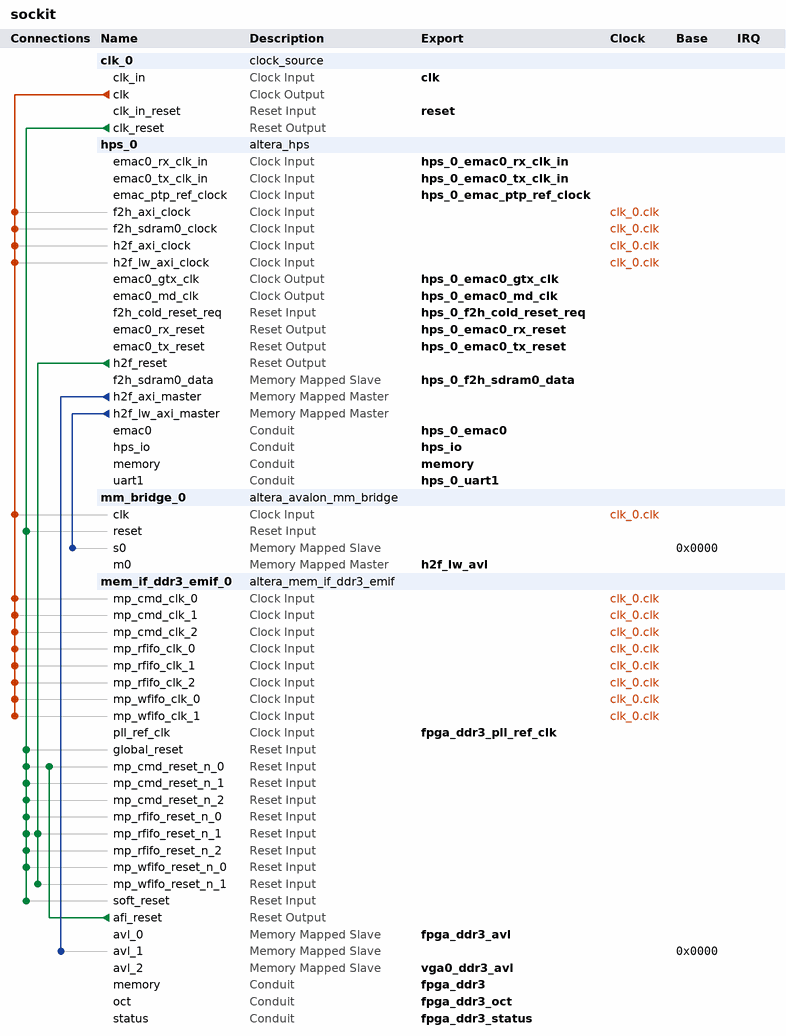
[diagram p0: system contents]
# Platform Designer (Qsys) system sockit, Cyclone V 5CSXFC6D6F31C8ES
# Parameters at their usual value, and those the tool derives, are not listed.
package require -exact qsys 13.0
create_system sockit
set_project_property DEVICE_FAMILY {Cyclone V}
set_project_property DEVICE 5CSXFC6D6F31C8ES

add_instance clk_0 clock_source 13.0
set_instance_parameter_value clk_0 clockFrequency 50000000

add_instance hps_0 altera_hps 13.0.1
set_instance_parameter_value hps_0 MEM_VENDOR Micron
set_instance_parameter_value hps_0 MEM_ROW_ADDR_WIDTH 15
set_instance_parameter_value hps_0 MEM_COL_ADDR_WIDTH 10
set_instance_parameter_value hps_0 MEM_DQ_WIDTH 32
set_instance_parameter_value hps_0 MEM_BANKADDR_WIDTH 3
set_instance_parameter_value hps_0 MEM_DRV_STR RZQ/7
set_instance_parameter_value hps_0 MEM_RTT_NOM RZQ/4
set_instance_parameter_value hps_0 MEM_RTT_WR RZQ/4
set_instance_parameter_value hps_0 MEM_WTCL 8
set_instance_parameter_value hps_0 MEM_TCL 11
set_instance_parameter_value hps_0 TIMING_TIS 180
set_instance_parameter_value hps_0 TIMING_TIH 140
set_instance_parameter_value hps_0 TIMING_TDS 30
set_instance_parameter_value hps_0 TIMING_TDH 65
set_instance_parameter_value hps_0 TIMING_TDQSQ 125
set_instance_parameter_value hps_0 TIMING_TDQSCK 255
set_instance_parameter_value hps_0 TIMING_TQSH 0.4
set_instance_parameter_value hps_0 MEM_TRAS_NS 35.0
set_instance_parameter_value hps_0 MEM_TRCD_NS 13.75
set_instance_parameter_value hps_0 MEM_TRP_NS 13.75
set_instance_parameter_value hps_0 MEM_TRFC_NS 260.0
set_instance_parameter_value hps_0 MEM_TFAW_NS 30.0
set_instance_parameter_value hps_0 REF_CLK_FREQ 25.0
set_instance_parameter_value hps_0 DEFAULT_FAST_SIM_MODEL true
set_instance_parameter_value hps_0 TIMING_BOARD_MAX_CK_DELAY 0.03
set_instance_parameter_value hps_0 TIMING_BOARD_MAX_DQS_DELAY 0.02
set_instance_parameter_value hps_0 TIMING_BOARD_SKEW_CKDQS_DIMM_MIN 0.09
set_instance_parameter_value hps_0 TIMING_BOARD_SKEW_CKDQS_DIMM_MAX 0.16
set_instance_parameter_value hps_0 TIMING_BOARD_SKEW_WITHIN_DQS 0.02
set_instance_parameter_value hps_0 TIMING_BOARD_SKEW_BETWEEN_DQS 0.08
set_instance_parameter_value hps_0 TIMING_BOARD_DQ_TO_DQS_SKEW 0.0
set_instance_parameter_value hps_0 TIMING_BOARD_AC_SKEW 0.03
set_instance_parameter_value hps_0 TIMING_BOARD_AC_TO_CK_SKEW 0.0
set_instance_parameter_value hps_0 MEM_CLK_FREQ 400.0
set_instance_parameter_value hps_0 HPS_PROTOCOL DDR3
set_instance_parameter_value hps_0 STM_Enable false
set_instance_parameter_value hps_0 F2S_Width 2
set_instance_parameter_value hps_0 S2F_Width 2
set_instance_parameter_value hps_0 LWH2F_Enable true
set_instance_parameter_value hps_0 F2SDRAM_Type {Avalon-MM Bidirectional}
set_instance_parameter_value hps_0 F2SDRAM_Width 32
set_instance_parameter_value hps_0 F2SCLK_DBGRST_Enable false
set_instance_parameter_value hps_0 F2SCLK_WARMRST_Enable false
set_instance_parameter_value hps_0 F2SCLK_COLDRST_Enable true
set_instance_parameter_value hps_0 F2SINTERRUPT_Enable false
set_instance_parameter_value hps_0 EMAC0_PinMuxing FPGA
set_instance_parameter_value hps_0 EMAC0_Mode Full
set_instance_parameter_value hps_0 EMAC1_PinMuxing {HPS I/O Set 0}
set_instance_parameter_value hps_0 EMAC1_Mode RGMII
set_instance_parameter_value hps_0 QSPI_PinMuxing {HPS I/O Set 0}
set_instance_parameter_value hps_0 QSPI_Mode {1 SS}
set_instance_parameter_value hps_0 SDIO_PinMuxing {HPS I/O Set 0}
set_instance_parameter_value hps_0 SDIO_Mode {4-bit Data}
set_instance_parameter_value hps_0 USB1_PinMuxing {HPS I/O Set 0}
set_instance_parameter_value hps_0 USB1_Mode SDR
set_instance_parameter_value hps_0 SPIM0_PinMuxing {HPS I/O Set 0}
set_instance_parameter_value hps_0 SPIM0_Mode {Single Slave Select}
set_instance_parameter_value hps_0 SPIM1_PinMuxing {HPS I/O Set 0}
set_instance_parameter_value hps_0 SPIM1_Mode {Single Slave Select}
set_instance_parameter_value hps_0 UART0_PinMuxing {HPS I/O Set 0}
set_instance_parameter_value hps_0 UART0_Mode {No Flow Control}
set_instance_parameter_value hps_0 UART1_PinMuxing FPGA
set_instance_parameter_value hps_0 UART1_Mode Full
set_instance_parameter_value hps_0 I2C0_PinMuxing Unused
set_instance_parameter_value hps_0 I2C0_Mode N/A
set_instance_parameter_value hps_0 I2C1_PinMuxing {HPS I/O Set 0}
set_instance_parameter_value hps_0 I2C1_Mode I2C
set_instance_parameter_value hps_0 S2FCLK_USER1CLK_FREQ 100
set_instance_parameter_value hps_0 FPGA_PERIPHERAL_OUTPUT_CLOCK_FREQ_EMAC0_MD_CLK 100
set_instance_parameter_value hps_0 FPGA_PERIPHERAL_OUTPUT_CLOCK_FREQ_EMAC0_GTX_CLK 100
set_instance_parameter_value hps_0 FPGA_PERIPHERAL_OUTPUT_CLOCK_FREQ_EMAC1_MD_CLK 100
set_instance_parameter_value hps_0 FPGA_PERIPHERAL_OUTPUT_CLOCK_FREQ_EMAC1_GTX_CLK 100
set_instance_parameter_value hps_0 quartus_ini_hps_ip_enable_loanio false

add_instance mm_bridge_0 altera_avalon_mm_bridge 13.0
set_instance_parameter_value mm_bridge_0 DATA_WIDTH 32
set_instance_parameter_value mm_bridge_0 ADDRESS_WIDTH 21
set_instance_parameter_value mm_bridge_0 ADDRESS_UNITS SYMBOLS
set_instance_parameter_value mm_bridge_0 MAX_PENDING_RESPONSES 4
set_instance_parameter_value mm_bridge_0 LINEWRAPBURSTS 1

add_instance mem_if_ddr3_emif_0 altera_mem_if_ddr3_emif 13.0
set_instance_parameter_value mem_if_ddr3_emif_0 MEM_VENDOR Micron
set_instance_parameter_value mem_if_ddr3_emif_0 MEM_FORMAT DISCRETE
set_instance_parameter_value mem_if_ddr3_emif_0 MEM_CLK_FREQ_MAX 800.0
set_instance_parameter_value mem_if_ddr3_emif_0 MEM_ROW_ADDR_WIDTH 15
set_instance_parameter_value mem_if_ddr3_emif_0 MEM_COL_ADDR_WIDTH 10
set_instance_parameter_value mem_if_ddr3_emif_0 MEM_DQ_WIDTH 32
set_instance_parameter_value mem_if_ddr3_emif_0 MEM_BANKADDR_WIDTH 3
set_instance_parameter_value mem_if_ddr3_emif_0 MEM_WTCL 5
set_instance_parameter_value mem_if_ddr3_emif_0 MEM_TCL 6
set_instance_parameter_value mem_if_ddr3_emif_0 TIMING_TIS 200
set_instance_parameter_value mem_if_ddr3_emif_0 TIMING_TIH 275
set_instance_parameter_value mem_if_ddr3_emif_0 TIMING_TDS 75
set_instance_parameter_value mem_if_ddr3_emif_0 TIMING_TDH 150
set_instance_parameter_value mem_if_ddr3_emif_0 TIMING_TDQSQ 200
set_instance_parameter_value mem_if_ddr3_emif_0 TIMING_TDQSCK 400
set_instance_parameter_value mem_if_ddr3_emif_0 TIMING_TDQSS 0.25
set_instance_parameter_value mem_if_ddr3_emif_0 TIMING_TQSH 0.38
set_instance_parameter_value mem_if_ddr3_emif_0 TIMING_TDSH 0.2
set_instance_parameter_value mem_if_ddr3_emif_0 TIMING_TDSS 0.2
set_instance_parameter_value mem_if_ddr3_emif_0 MEM_TMRD_CK 3
set_instance_parameter_value mem_if_ddr3_emif_0 MEM_TRAS_NS 37.5
set_instance_parameter_value mem_if_ddr3_emif_0 MEM_TRCD_NS 15.0
set_instance_parameter_value mem_if_ddr3_emif_0 MEM_TRP_NS 15.0
set_instance_parameter_value mem_if_ddr3_emif_0 MEM_TRFC_NS 300.0
set_instance_parameter_value mem_if_ddr3_emif_0 MEM_TWTR 4
set_instance_parameter_value mem_if_ddr3_emif_0 MEM_TFAW_NS 50.0
set_instance_parameter_value mem_if_ddr3_emif_0 MEM_TRRD_NS 13.2
set_instance_parameter_value mem_if_ddr3_emif_0 MEM_TRTP_NS 13.2
set_instance_parameter_value mem_if_ddr3_emif_0 RATE Full
set_instance_parameter_value mem_if_ddr3_emif_0 MEM_CLK_FREQ 300.0
set_instance_parameter_value mem_if_ddr3_emif_0 SPEED_GRADE 8
set_instance_parameter_value mem_if_ddr3_emif_0 HARD_EMIF true
set_instance_parameter_value mem_if_ddr3_emif_0 POWER_OF_TWO_BUS true
set_instance_parameter_value mem_if_ddr3_emif_0 AVL_MAX_SIZE 32
set_instance_parameter_value mem_if_ddr3_emif_0 NUM_OF_PORTS 3
set_instance_parameter_value mem_if_ddr3_emif_0 PRIORITY_PORT 1,1,1,1,1,1
set_instance_parameter_value mem_if_ddr3_emif_0 CPORT_TYPE_PORT Bidirectional,Bidirectional,Read-only,Bidirectional,Bidirectional,Bidirectional
set_instance_parameter_value mem_if_ddr3_emif_0 REF_CLK_FREQ 50.0
set_instance_parameter_value mem_if_ddr3_emif_0 DEFAULT_FAST_SIM_MODEL true
set_instance_parameter_value mem_if_ddr3_emif_0 EXPORT_AFI_HALF_CLK false
set_instance_parameter_value mem_if_ddr3_emif_0 PLL_LOCATION Top_Bottom
set_instance_parameter_value mem_if_ddr3_emif_0 CALIBRATION_MODE Full
set_instance_parameter_value mem_if_ddr3_emif_0 USER_DEBUG_LEVEL 0
set_instance_parameter_value mem_if_ddr3_emif_0 TIMING_BOARD_MAX_CK_DELAY 0.6
set_instance_parameter_value mem_if_ddr3_emif_0 TIMING_BOARD_MAX_DQS_DELAY 0.6
set_instance_parameter_value mem_if_ddr3_emif_0 TIMING_BOARD_SKEW_CKDQS_DIMM_MIN -0.01
set_instance_parameter_value mem_if_ddr3_emif_0 TIMING_BOARD_SKEW_CKDQS_DIMM_MAX 0.01
set_instance_parameter_value mem_if_ddr3_emif_0 TIMING_BOARD_SKEW_WITHIN_DQS 0.02
set_instance_parameter_value mem_if_ddr3_emif_0 TIMING_BOARD_SKEW_BETWEEN_DQS 0.02
set_instance_parameter_value mem_if_ddr3_emif_0 TIMING_BOARD_DQ_TO_DQS_SKEW 0.0
set_instance_parameter_value mem_if_ddr3_emif_0 TIMING_BOARD_AC_SKEW 0.02
set_instance_parameter_value mem_if_ddr3_emif_0 TIMING_BOARD_AC_TO_CK_SKEW 0.0

# connections
add_connection clk_0.clk hps_0.f2h_axi_clock clock
add_connection clk_0.clk hps_0.f2h_sdram0_clock clock
add_connection clk_0.clk hps_0.h2f_axi_clock clock
add_connection clk_0.clk hps_0.h2f_lw_axi_clock clock
add_connection clk_0.clk mem_if_ddr3_emif_0.mp_cmd_clk_0 clock
add_connection clk_0.clk mem_if_ddr3_emif_0.mp_cmd_clk_1 clock
add_connection clk_0.clk mem_if_ddr3_emif_0.mp_cmd_clk_2 clock
add_connection clk_0.clk mem_if_ddr3_emif_0.mp_rfifo_clk_0 clock
add_connection clk_0.clk mem_if_ddr3_emif_0.mp_rfifo_clk_1 clock
add_connection clk_0.clk mem_if_ddr3_emif_0.mp_rfifo_clk_2 clock
add_connection clk_0.clk mem_if_ddr3_emif_0.mp_wfifo_clk_0 clock
add_connection clk_0.clk mem_if_ddr3_emif_0.mp_wfifo_clk_1 clock
add_connection clk_0.clk mm_bridge_0.clk clock
add_connection clk_0.clk_reset mem_if_ddr3_emif_0.global_reset reset
add_connection clk_0.clk_reset mem_if_ddr3_emif_0.mp_cmd_reset_n_0 reset
add_connection clk_0.clk_reset mem_if_ddr3_emif_0.mp_cmd_reset_n_1 reset
add_connection clk_0.clk_reset mem_if_ddr3_emif_0.mp_cmd_reset_n_2 reset
add_connection clk_0.clk_reset mem_if_ddr3_emif_0.mp_rfifo_reset_n_0 reset
add_connection clk_0.clk_reset mem_if_ddr3_emif_0.mp_rfifo_reset_n_1 reset
add_connection clk_0.clk_reset mem_if_ddr3_emif_0.mp_rfifo_reset_n_2 reset
add_connection clk_0.clk_reset mem_if_ddr3_emif_0.mp_wfifo_reset_n_0 reset
add_connection clk_0.clk_reset mem_if_ddr3_emif_0.soft_reset reset
add_connection clk_0.clk_reset mm_bridge_0.reset reset
add_connection hps_0.h2f_reset mem_if_ddr3_emif_0.mp_rfifo_reset_n_1 reset
add_connection hps_0.h2f_reset mem_if_ddr3_emif_0.mp_wfifo_reset_n_1 reset
add_connection mem_if_ddr3_emif_0.afi_reset mem_if_ddr3_emif_0.mp_cmd_reset_n_0 reset
add_connection hps_0.h2f_axi_master mem_if_ddr3_emif_0.avl_1 avalon
set_connection_parameter_value hps_0.h2f_axi_master/mem_if_ddr3_emif_0.avl_1 baseAddress 0x0000
add_connection hps_0.h2f_lw_axi_master mm_bridge_0.s0 avalon
set_connection_parameter_value hps_0.h2f_lw_axi_master/mm_bridge_0.s0 baseAddress 0x0000

# exported interfaces
add_interface clk clock sink
set_interface_property clk EXPORT_OF clk_0.clk_in
add_interface reset reset sink
set_interface_property reset EXPORT_OF clk_0.clk_in_reset
add_interface memory conduit end
set_interface_property memory EXPORT_OF hps_0.memory
add_interface hps_io conduit end
set_interface_property hps_io EXPORT_OF hps_0.hps_io
add_interface hps_0_uart1 conduit end
set_interface_property hps_0_uart1 EXPORT_OF hps_0.uart1
add_interface hps_0_emac0 conduit end
set_interface_property hps_0_emac0 EXPORT_OF hps_0.emac0
add_interface hps_0_emac0_md_clk clock source
set_interface_property hps_0_emac0_md_clk EXPORT_OF hps_0.emac0_md_clk
add_interface hps_0_emac0_rx_clk_in clock sink
set_interface_property hps_0_emac0_rx_clk_in EXPORT_OF hps_0.emac0_rx_clk_in
add_interface hps_0_emac0_tx_clk_in clock sink
set_interface_property hps_0_emac0_tx_clk_in EXPORT_OF hps_0.emac0_tx_clk_in
add_interface hps_0_emac0_gtx_clk clock source
set_interface_property hps_0_emac0_gtx_clk EXPORT_OF hps_0.emac0_gtx_clk
add_interface hps_0_emac0_tx_reset reset source
set_interface_property hps_0_emac0_tx_reset EXPORT_OF hps_0.emac0_tx_reset
add_interface hps_0_emac0_rx_reset reset source
set_interface_property hps_0_emac0_rx_reset EXPORT_OF hps_0.emac0_rx_reset
add_interface hps_0_emac_ptp_ref_clock clock sink
set_interface_property hps_0_emac_ptp_ref_clock EXPORT_OF hps_0.emac_ptp_ref_clock
add_interface hps_0_f2h_sdram0_data avalon slave
set_interface_property hps_0_f2h_sdram0_data EXPORT_OF hps_0.f2h_sdram0_data
add_interface hps_0_f2h_cold_reset_req reset sink
set_interface_property hps_0_f2h_cold_reset_req EXPORT_OF hps_0.f2h_cold_reset_req
add_interface fpga_ddr3 conduit end
set_interface_property fpga_ddr3 EXPORT_OF mem_if_ddr3_emif_0.memory
add_interface fpga_ddr3_oct conduit end
set_interface_property fpga_ddr3_oct EXPORT_OF mem_if_ddr3_emif_0.oct
add_interface fpga_ddr3_status conduit end
set_interface_property fpga_ddr3_status EXPORT_OF mem_if_ddr3_emif_0.status
add_interface fpga_ddr3_avl avalon slave
set_interface_property fpga_ddr3_avl EXPORT_OF mem_if_ddr3_emif_0.avl_0
add_interface h2f_lw_avl avalon master
set_interface_property h2f_lw_avl EXPORT_OF mm_bridge_0.m0
add_interface vga0_ddr3_avl avalon slave
set_interface_property vga0_ddr3_avl EXPORT_OF mem_if_ddr3_emif_0.avl_2
add_interface fpga_ddr3_pll_ref_clk clock sink
set_interface_property fpga_ddr3_pll_ref_clk EXPORT_OF mem_if_ddr3_emif_0.pll_ref_clk

set_interconnect_requirement {$system} qsys_mm.clockCrossingAdapter HANDSHAKE
set_interconnect_requirement {$system} qsys_mm.maxAdditionalLatency 1

save_system sockit.qsys
